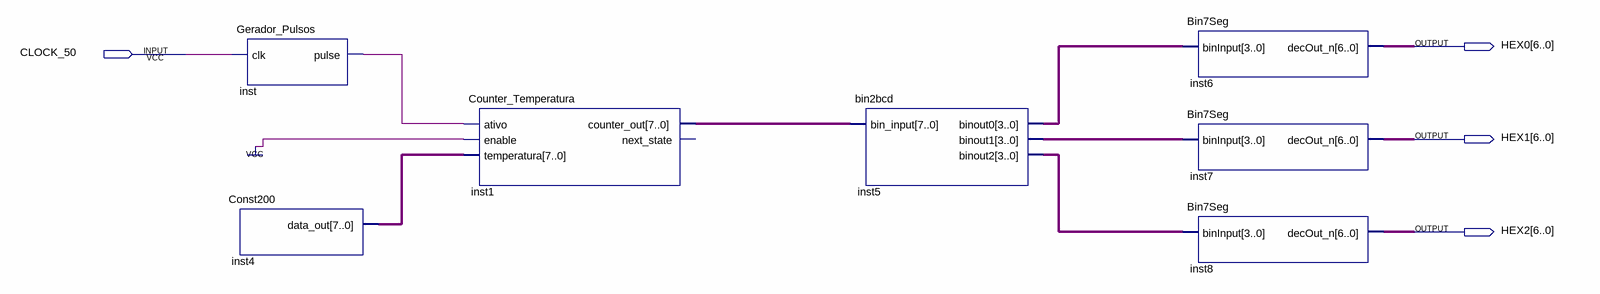
[diagram p0: schematic sheet]
// Quartus schematic tentativa2.bdf as structural Verilog: 7 symbols, 4 pins
module tentativa2 (
  input  CLOCK_50,
  output [6:0] HEX0,
  output [6:0] HEX1,
  output [6:0] HEX2
);

  wire inst_pulse;
  wire [3:0] inst5_binout0, inst5_binout1, inst5_binout2;
  wire [7:0] inst1_counter_out, inst4_data_out;

  Gerador_Pulsos inst (.clk(CLOCK_50), .pulse(inst_pulse));
  Const200 inst4 (.data_out(inst4_data_out));
  Counter_Temperatura inst1 (
    .ativo(inst_pulse), .enable(1'b1), .temperatura(inst4_data_out), .counter_out(inst1_counter_out));  // open: next_state
  bin2bcd inst5 (
    .bin_input(inst1_counter_out), .binout0(inst5_binout0), .binout1(inst5_binout1), .binout2(inst5_binout2));
  Bin7Seg inst6 (.binInput(inst5_binout0), .decOut_n(HEX0));
  Bin7Seg inst7 (.binInput(inst5_binout1), .decOut_n(HEX1));
  Bin7Seg inst8 (.binInput(inst5_binout2), .decOut_n(HEX2));
endmodule
